# Altium schematic sheet 7Seg.SchDoc
size A4; Organization: Altium Limited; Address1: L3, 12a Rodborough Rd; Address2: Frenchs Forest; Address3: NSW; Address4: Australia 2086; DocumentNumber: 3; SheetNumber: 3; SheetTotal: 4
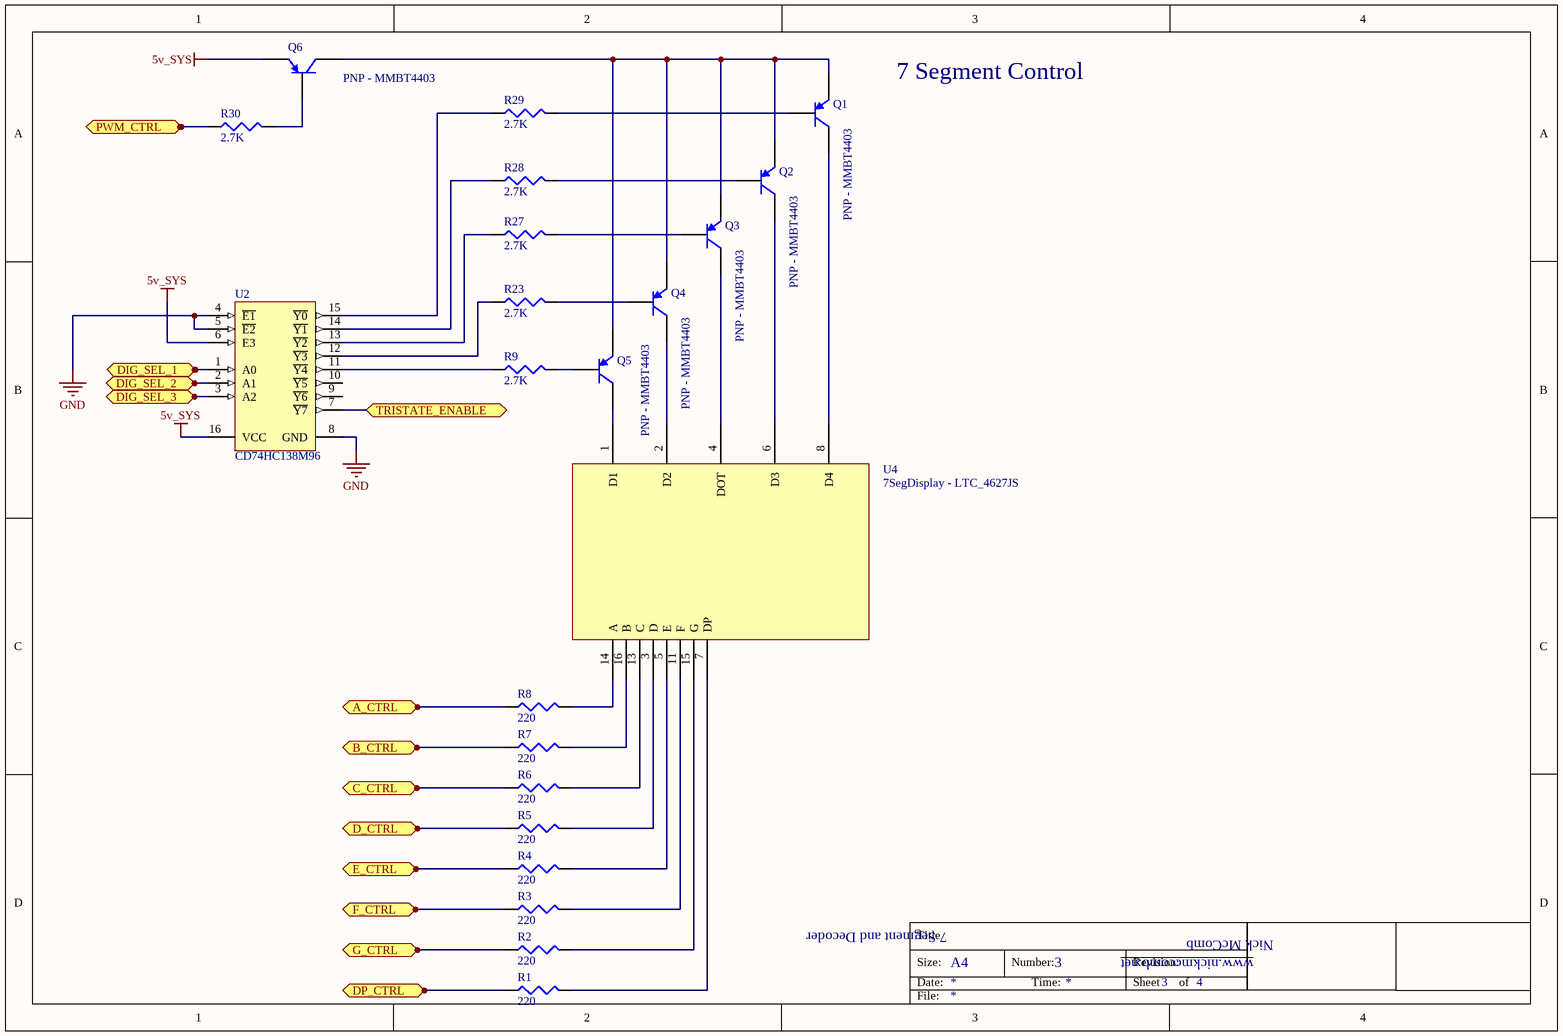
[diagram p0: 7Seg.SchDoc]

## Parts
Q1  PNP - MMBT4403  [TO-92A - BJT]
Q2  PNP - MMBT4403  [TO-92A - BJT]
Q3  PNP - MMBT4403  [TO-92A - BJT]
Q4  PNP - MMBT4403  [TO-92A - BJT]
Q5  PNP - MMBT4403  [TO-92A - BJT]
Q6  PNP - MMBT4403  [TO-92A - BJT]
R1  220  [J1-0603]
R2  220  [J1-0603]
R3  220  [J1-0603]
R4  220  [J1-0603]
R5  220  [J1-0603]
R6  220  [J1-0603]
R7  220  [J1-0603]
R8  220  [J1-0603]
R9  2.7K  [J1-0603]
R23  2.7K  [J1-0603]
R27  2.7K  [J1-0603]
R28  2.7K  [J1-0603]
R29  2.7K  [J1-0603]
R30  2.7K  [J1-0603]
U2  CD74HC138M96  [D0016A_L]
U4  7SegDisplay - LTC_4627JS

## Ports
A_CTRL, B_CTRL, C_CTRL, D_CTRL, DIG_SEL_1, DIG_SEL_2, DIG_SEL_3, DP_CTRL, E_CTRL, F_CTRL, G_CTRL, PWM_CTRL, TRISTATE_ENABLE

## Nets
5v_SYS: Q6.3(E) U2.6(E3) U2.16(VCC)
GND: U2.4(~{E1}) U2.5(~{E2}) U2.8(GND)
A_CTRL: R8.1 ; port A_CTRL
B_CTRL: R7.1 ; port B_CTRL
C_CTRL: R6.1 ; port C_CTRL
D_CTRL: R5.1 ; port D_CTRL
DIG_SEL_1: U2.1(A0) ; port DIG_SEL_1
DIG_SEL_2: U2.2(A1) ; port DIG_SEL_2
DIG_SEL_3: U2.3(A2) ; port DIG_SEL_3
DP_CTRL: R1.1 ; port DP_CTRL
E_CTRL: R4.1 ; port E_CTRL
F_CTRL: R3.1 ; port F_CTRL
G_CTRL: R2.1 ; port G_CTRL
PWM_CTRL: R30.1 ; port PWM_CTRL
TRISTATE_ENABLE: U2.7(~{Y7}) ; port TRISTATE_ENABLE
NetQ1_1: Q1.1(C) U4.8(D4)
NetQ1_2: Q1.2(B) R29.2
NetQ1_3: Q1.3(E) Q2.3(E) Q3.3(E) Q4.3(E) Q5.3(E) Q6.1(C)
NetQ2_1: Q2.1(C) U4.6(D3)
NetQ2_2: Q2.2(B) R28.2
NetQ3_1: Q3.1(C) U4.4(DOT)
NetQ3_2: Q3.2(B) R27.2
NetQ4_1: Q4.1(C) U4.2(D2)
NetQ4_2: Q4.2(B) R23.2
NetQ5_1: Q5.1(C) U4.1(D1)
NetQ5_2: Q5.2(B) R9.2
NetQ6_2: Q6.2(B) R30.2
NetR1_2: R1.2 U4.7(DP)
NetR2_2: R2.2 U4.15(G)
NetR3_2: R3.2 U4.11(F)
NetR4_2: R4.2 U4.5(E)
NetR5_2: R5.2 U4.3(D)
NetR6_2: R6.2 U4.13(C)
NetR7_2: R7.2 U4.16(B)
NetR8_2: R8.2 U4.14(A)
NetR9_1: R9.1 U2.11(~{Y4})
NetR23_1: R23.1 U2.12(~{Y3})
NetR27_1: R27.1 U2.13(~{Y2})
NetR28_1: R28.1 U2.14(~{Y1})
NetR29_1: R29.1 U2.15(~{Y0})

Not connected (* = marked no-connect by the designer): U2 9(~{Y6}) 10(~{Y5})

## Notes on the sheet
- 7 Segment Control
- 7 Segment and Decoder
- Title
- Size:
- Date:
- A4
- Number:
- Time:
- Revision:
- Sheet
- of
- www.nickmccomb.net
- Nick McComb
- File:

## Library data of the parts
Q1-Q6 = PNP - MMBT4403: PNP Bipolar Transistor
R1-R9 R23 R27-R30 = Res3: Resistor; Published: 8-Jun-2000; LatestRevisionDate: 29-May-2009; LatestRevisionNote: IPC-7351 Footprint Added.; PackageReference: J1-0603; Publisher: Altium Limited; PackageDescription: Chip Resistor
  R1-R8: Value: 220
  R9 R23 R27-R30: Value: 2.7K
U2 = CMP-1633-00157-2: High Speed CMOS Logic 3-to-8 Line Decoder Demultiplexer Inverting and Non-Inverting, D0016A, LARGE T&R; Manufacturer: Texas Instruments; VCC(Max)(V): 6; Technology Family: HC; Function: Decoder/Demultiplexer; tpd @ Nom Voltage(Max)(ns): 30; ICC @ Nom Voltage(Max)(mA): 0.08; Input Type: LVTTL/CMOS; Configuration: 3：8; Voltage(Nom)(V): 3.3,5; Schmitt Trigger: No; Channels(#): 1; Output Drive (IOL/IOH)(Max)(mA): 5.2/-5.2; F @ Nom Voltage(Max)(Mhz): 28; VCC(Min)(V): 2; Bits(#): 8; Rating: Catalog; PackageReference: D0016A; Operating Temperature Range(C): -55 to 125; Code_JEDEC: MS-012 variation AC; Generic Part Number: CD74HC138; Output Type: CMOS; DatasheetVersion: SCHS147I; Type: Standard
U4 = 7SegDisplay